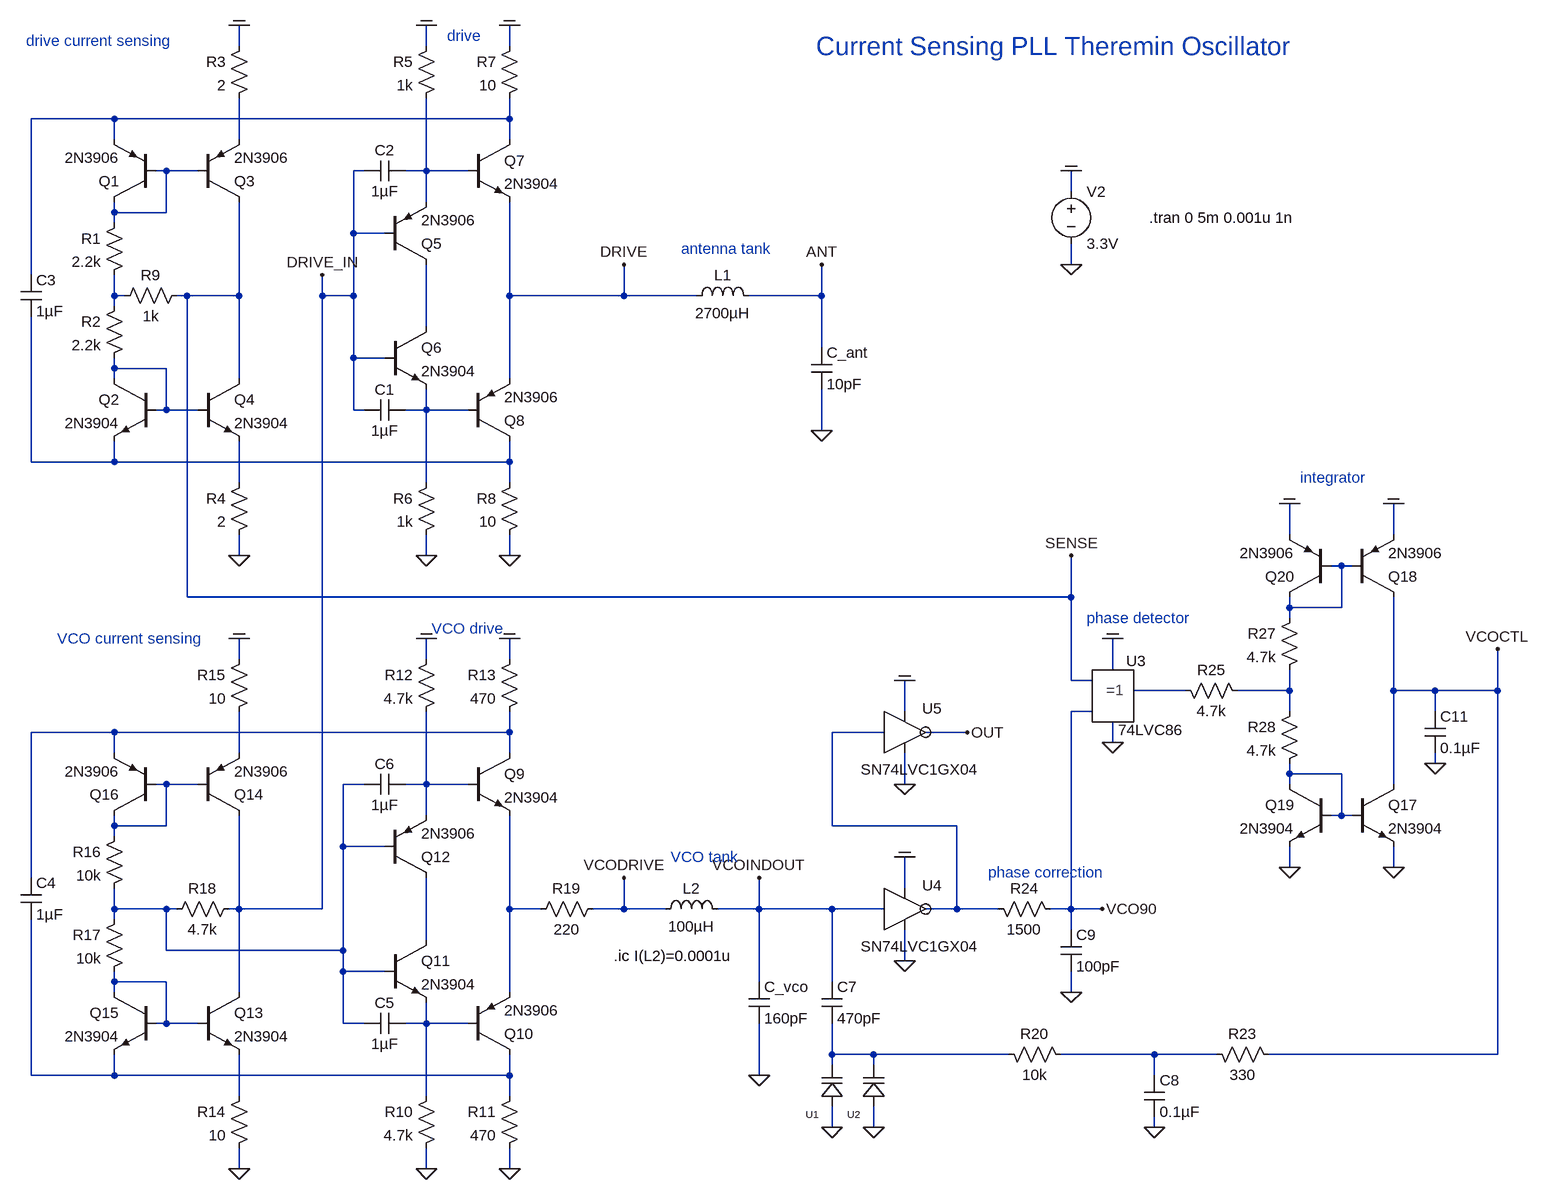
[diagram p0: schematic 2021_current_sensing_pll_bjts_01.asc]
2021_current_sensing_pll_bjts_01.asc, the LTspice schematic file:
Version 4
SHEET 1 13280 8692
WIRE 1984 3888 1984 3856
WIRE 2272 3888 2272 3856
WIRE 2400 3888 2400 3856
WIRE 1792 4000 1664 4000
WIRE 2400 4000 2400 3968
WIRE 2400 4000 1792 4000
WIRE 1792 4032 1792 4000
WIRE 1984 4032 1984 3968
WIRE 2400 4032 2400 4000
WIRE 1872 4080 1856 4080
WIRE 1920 4080 1872 4080
WIRE 2176 4080 2160 4080
WIRE 2272 4080 2272 3968
WIRE 2272 4080 2240 4080
WIRE 2336 4080 2272 4080
WIRE 3264 4112 3264 4080
WIRE 2272 4128 2272 4080
WIRE 1792 4144 1792 4128
WIRE 1872 4144 1872 4080
WIRE 1872 4144 1792 4144
WIRE 1792 4160 1792 4144
WIRE 2160 4176 2160 4080
WIRE 2208 4176 2160 4176
WIRE 3264 4224 3264 4192
WIRE 1664 4240 1664 4000
WIRE 1792 4272 1792 4240
WIRE 1808 4272 1792 4272
WIRE 1904 4272 1888 4272
WIRE 1984 4272 1984 4128
WIRE 1984 4272 1904 4272
WIRE 2112 4272 2112 4240
WIRE 2160 4272 2160 4176
WIRE 2160 4272 2112 4272
WIRE 2400 4272 2400 4128
WIRE 2576 4272 2576 4224
WIRE 2576 4272 2400 4272
WIRE 2688 4272 2576 4272
WIRE 2880 4272 2880 4224
WIRE 2880 4272 2768 4272
WIRE 1792 4288 1792 4272
WIRE 2272 4320 2272 4224
WIRE 2880 4352 2880 4272
WIRE 2160 4368 2160 4272
WIRE 2208 4368 2160 4368
WIRE 1792 4384 1792 4368
WIRE 1872 4384 1792 4384
WIRE 1792 4400 1792 4384
WIRE 1984 4400 1984 4272
WIRE 2400 4400 2400 4272
WIRE 1872 4448 1872 4384
WIRE 1872 4448 1856 4448
WIRE 1920 4448 1872 4448
WIRE 2160 4448 2160 4368
WIRE 2176 4448 2160 4448
WIRE 2272 4448 2272 4416
WIRE 2272 4448 2240 4448
WIRE 2336 4448 2272 4448
WIRE 2880 4480 2880 4416
WIRE 1664 4528 1664 4304
WIRE 1792 4528 1792 4496
WIRE 1792 4528 1664 4528
WIRE 2400 4528 2400 4496
WIRE 2400 4528 1792 4528
WIRE 1984 4560 1984 4496
WIRE 2272 4560 2272 4448
WIRE 2400 4560 2400 4528
WIRE 3600 4640 3600 4592
WIRE 3760 4640 3760 4592
WIRE 1984 4672 1984 4640
WIRE 2272 4672 2272 4640
WIRE 2400 4672 2400 4640
WIRE 3680 4688 3664 4688
WIRE 3696 4688 3680 4688
WIRE 1904 4736 1904 4272
WIRE 3264 4736 3264 4672
WIRE 3264 4736 1904 4736
WIRE 3600 4752 3600 4736
WIRE 3680 4752 3680 4688
WIRE 3680 4752 3600 4752
WIRE 3600 4768 3600 4752
WIRE 1984 4832 1984 4800
WIRE 2272 4832 2272 4800
WIRE 2400 4832 2400 4800
WIRE 3328 4848 3328 4800
WIRE 3264 4864 3264 4736
WIRE 3296 4864 3264 4864
WIRE 3440 4880 3360 4880
WIRE 3600 4880 3600 4848
WIRE 3600 4880 3520 4880
WIRE 3760 4880 3760 4736
WIRE 3824 4880 3760 4880
WIRE 3920 4880 3920 4816
WIRE 3920 4880 3824 4880
WIRE 3008 4912 3008 4864
WIRE 3296 4912 3264 4912
WIRE 3600 4912 3600 4880
WIRE 3824 4912 3824 4880
WIRE 1792 4944 1664 4944
WIRE 2400 4944 2400 4912
WIRE 2400 4944 1792 4944
WIRE 2976 4944 2896 4944
WIRE 3104 4944 3040 4944
WIRE 3328 4960 3328 4928
WIRE 1792 4976 1792 4944
WIRE 1984 4976 1984 4912
WIRE 2400 4976 2400 4944
WIRE 3824 4992 3824 4976
WIRE 3600 5008 3600 4992
WIRE 3680 5008 3600 5008
WIRE 1872 5024 1856 5024
WIRE 1920 5024 1872 5024
WIRE 2176 5024 2144 5024
WIRE 2272 5024 2272 4912
WIRE 2272 5024 2240 5024
WIRE 2336 5024 2272 5024
WIRE 3008 5024 3008 4976
WIRE 3600 5024 3600 5008
WIRE 3760 5024 3760 4880
WIRE 2272 5072 2272 5024
WIRE 3680 5072 3680 5008
WIRE 3680 5072 3664 5072
WIRE 3696 5072 3680 5072
WIRE 1792 5088 1792 5072
WIRE 1872 5088 1872 5024
WIRE 1872 5088 1792 5088
WIRE 2896 5088 2896 4944
WIRE 3088 5088 2896 5088
WIRE 1792 5104 1792 5088
WIRE 2144 5120 2144 5024
WIRE 2208 5120 2144 5120
WIRE 3600 5152 3600 5120
WIRE 3760 5152 3760 5120
WIRE 1664 5168 1664 4944
WIRE 3008 5184 3008 5136
WIRE 1792 5216 1792 5184
WIRE 1872 5216 1792 5216
WIRE 1888 5216 1872 5216
WIRE 1984 5216 1984 5072
WIRE 1984 5216 1968 5216
WIRE 2112 5216 2112 4272
WIRE 2112 5216 1984 5216
WIRE 2400 5216 2400 5072
WIRE 2448 5216 2400 5216
WIRE 2576 5216 2576 5168
WIRE 2576 5216 2528 5216
WIRE 2640 5216 2576 5216
WIRE 2784 5216 2784 5168
WIRE 2784 5216 2720 5216
WIRE 2896 5216 2784 5216
WIRE 2976 5216 2896 5216
WIRE 3088 5216 3088 5088
WIRE 3088 5216 3040 5216
WIRE 3152 5216 3088 5216
WIRE 3264 5216 3264 4912
WIRE 3264 5216 3232 5216
WIRE 3312 5216 3264 5216
WIRE 1792 5232 1792 5216
WIRE 3264 5248 3264 5216
WIRE 2272 5264 2272 5168
WIRE 1872 5280 1872 5216
WIRE 2144 5280 2144 5120
WIRE 2144 5280 1872 5280
WIRE 3008 5296 3008 5248
WIRE 2144 5312 2144 5280
WIRE 2208 5312 2144 5312
WIRE 1792 5328 1792 5312
WIRE 1872 5328 1792 5328
WIRE 2784 5328 2784 5216
WIRE 2896 5328 2896 5216
WIRE 1792 5344 1792 5328
WIRE 1984 5344 1984 5216
WIRE 2400 5344 2400 5216
WIRE 3264 5344 3264 5312
WIRE 1872 5392 1872 5328
WIRE 1872 5392 1856 5392
WIRE 1920 5392 1872 5392
WIRE 2144 5392 2144 5312
WIRE 2176 5392 2144 5392
WIRE 2272 5392 2272 5360
WIRE 2272 5392 2240 5392
WIRE 2336 5392 2272 5392
WIRE 2896 5440 2896 5392
WIRE 2960 5440 2896 5440
WIRE 3168 5440 2960 5440
WIRE 3392 5440 3248 5440
WIRE 3488 5440 3392 5440
WIRE 3920 5440 3920 4880
WIRE 3920 5440 3568 5440
WIRE 2896 5456 2896 5440
WIRE 2960 5456 2960 5440
WIRE 1664 5472 1664 5232
WIRE 1792 5472 1792 5440
WIRE 1792 5472 1664 5472
WIRE 2400 5472 2400 5440
WIRE 2400 5472 1792 5472
WIRE 2784 5472 2784 5392
WIRE 3392 5472 3392 5440
WIRE 1984 5504 1984 5440
WIRE 2272 5504 2272 5392
WIRE 2400 5504 2400 5472
WIRE 2896 5552 2896 5520
WIRE 2960 5552 2960 5520
WIRE 3392 5552 3392 5536
WIRE 1984 5616 1984 5584
WIRE 2272 5616 2272 5584
WIRE 2400 5616 2400 5584
FLAG 3264 4224 0
FLAG 3264 4080 COM
FLAG 1984 4672 0
FLAG 1984 3856 COM
FLAG 2880 4480 0
FLAG 2880 4224 ANT
FLAG 2576 4224 DRIVE
FLAG 2272 4672 0
FLAG 2400 4672 0
FLAG 2272 3856 COM
FLAG 2400 3856 COM
FLAG 2112 4240 DRIVE_IN
FLAG 2272 5616 0
FLAG 2400 5616 0
FLAG 2272 4800 COM
FLAG 2400 4800 COM
FLAG 2784 5472 0
FLAG 2784 5168 VCOINDOUT
FLAG 2576 5168 VCODRIVE
FLAG 1984 5616 0
FLAG 1984 4800 COM
FLAG 2896 5552 0
FLAG 2960 5552 0
FLAG 3392 5552 0
FLAG 3328 4800 COM
FLAG 3328 4960 0
FLAG 3008 5136 COM
FLAG 3008 4864 COM
FLAG 3008 5296 0
FLAG 3008 5024 0
FLAG 3104 4944 OUT
FLAG 3264 5344 0
FLAG 3760 5152 0
FLAG 3760 4592 COM
FLAG 3600 4592 COM
FLAG 3600 5152 0
FLAG 3824 4992 0
FLAG 3264 4672 SENSE
FLAG 3312 5216 VCO90
FLAG 3920 4816 VCOCTL
SYMBOL voltage 3264 4096 R0
WINDOW 123 0 0 Left 2
WINDOW 39 0 0 Left 2
SYMATTR InstName V2
SYMATTR Value 3.3V
SYMBOL npn 1920 4400 R0
SYMATTR InstName Q4
SYMATTR Value 2N3904
SYMBOL pnp 1920 4128 M180
SYMATTR InstName Q3
SYMATTR Value 2N3906
SYMBOL npn 1856 4400 M0
SYMATTR InstName Q2
SYMATTR Value 2N3904
SYMBOL pnp 1856 4128 R180
SYMATTR InstName Q1
SYMATTR Value 2N3906
SYMBOL res 2000 4544 M0
WINDOW 0 36 40 Left 2
WINDOW 3 36 76 Left 2
SYMATTR InstName R4
SYMATTR Value 2
SYMBOL res 2000 3872 M0
WINDOW 0 36 40 Left 2
WINDOW 3 36 76 Left 2
SYMATTR InstName R3
SYMATTR Value 2
SYMBOL res 1808 4144 M0
WINDOW 0 36 40 Left 2
WINDOW 3 36 76 Left 2
SYMATTR InstName R1
SYMATTR Value 2.2k
SYMBOL res 1808 4272 M0
WINDOW 0 36 40 Left 2
WINDOW 3 36 76 Left 2
SYMATTR InstName R2
SYMATTR Value 2.2k
SYMBOL ind 2672 4288 R270
WINDOW 0 32 56 VTop 2
WINDOW 3 5 56 VBottom 2
SYMATTR InstName L1
SYMATTR Value 2700µH
SYMATTR SpiceLine Rser=120 Cpar=1.2pF
SYMBOL cap 2864 4352 R0
SYMATTR InstName C_ant
SYMATTR Value 10pF
SYMBOL npn 2336 4032 R0
SYMATTR InstName Q7
SYMATTR Value 2N3904
SYMBOL pnp 2336 4496 M180
SYMATTR InstName Q8
SYMATTR Value 2N3906
SYMBOL npn 2208 4320 R0
SYMATTR InstName Q6
SYMATTR Value 2N3904
SYMBOL pnp 2208 4224 M180
SYMATTR InstName Q5
SYMATTR Value 2N3906
SYMBOL res 2288 4544 M0
WINDOW 0 36 40 Left 2
WINDOW 3 36 76 Left 2
SYMATTR InstName R6
SYMATTR Value 1k
SYMBOL res 2416 4544 M0
WINDOW 0 36 40 Left 2
WINDOW 3 36 76 Left 2
SYMATTR InstName R8
SYMATTR Value 10
SYMBOL res 2288 3872 M0
WINDOW 0 36 40 Left 2
WINDOW 3 36 76 Left 2
SYMATTR InstName R5
SYMATTR Value 1k
SYMBOL res 2416 3872 M0
WINDOW 0 36 40 Left 2
WINDOW 3 36 76 Left 2
SYMATTR InstName R7
SYMATTR Value 10
SYMBOL cap 1648 4240 R0
SYMATTR InstName C3
SYMATTR Value 1µF
SYMBOL res 1904 4256 R90
WINDOW 0 0 56 VBottom 2
WINDOW 3 32 56 VTop 2
SYMATTR InstName R9
SYMATTR Value 1k
SYMBOL cap 2240 4432 R90
WINDOW 0 0 32 VBottom 2
WINDOW 3 32 32 VTop 2
SYMATTR InstName C1
SYMATTR Value 1µF
SYMBOL cap 2240 4064 R90
WINDOW 0 0 32 VBottom 2
WINDOW 3 32 32 VTop 2
SYMATTR InstName C2
SYMATTR Value 1µF
SYMBOL npn 2336 4976 R0
SYMATTR InstName Q9
SYMATTR Value 2N3904
SYMBOL pnp 2336 5440 M180
SYMATTR InstName Q10
SYMATTR Value 2N3906
SYMBOL npn 2208 5264 R0
SYMATTR InstName Q11
SYMATTR Value 2N3904
SYMBOL pnp 2208 5168 M180
SYMATTR InstName Q12
SYMATTR Value 2N3906
SYMBOL res 2288 5488 M0
WINDOW 0 36 40 Left 2
WINDOW 3 36 76 Left 2
SYMATTR InstName R10
SYMATTR Value 4.7k
SYMBOL res 2416 5488 M0
WINDOW 0 36 40 Left 2
WINDOW 3 36 76 Left 2
SYMATTR InstName R11
SYMATTR Value 470
SYMBOL res 2288 4816 M0
WINDOW 0 36 40 Left 2
WINDOW 3 36 76 Left 2
SYMATTR InstName R12
SYMATTR Value 4.7k
SYMBOL res 2416 4816 M0
WINDOW 0 36 40 Left 2
WINDOW 3 36 76 Left 2
SYMATTR InstName R13
SYMATTR Value 470
SYMBOL cap 1648 5168 R0
SYMATTR InstName C4
SYMATTR Value 1µF
SYMBOL cap 2240 5376 R90
WINDOW 0 0 32 VBottom 2
WINDOW 3 32 32 VTop 2
SYMATTR InstName C5
SYMATTR Value 1µF
SYMBOL cap 2240 5008 R90
WINDOW 0 0 32 VBottom 2
WINDOW 3 32 32 VTop 2
SYMATTR InstName C6
SYMATTR Value 1µF
SYMBOL ind 2624 5232 R270
WINDOW 0 32 56 VTop 2
WINDOW 3 5 56 VBottom 2
SYMATTR InstName L2
SYMATTR Value 100µH
SYMATTR SpiceLine Rser=120 Cpar=1.2pF
SYMBOL cap 2768 5328 R0
SYMATTR InstName C_vco
SYMATTR Value 160pF
SYMBOL npn 1920 5344 R0
SYMATTR InstName Q13
SYMATTR Value 2N3904
SYMBOL pnp 1920 5072 M180
SYMATTR InstName Q14
SYMATTR Value 2N3906
SYMBOL npn 1856 5344 M0
SYMATTR InstName Q15
SYMATTR Value 2N3904
SYMBOL pnp 1856 5072 R180
SYMATTR InstName Q16
SYMATTR Value 2N3906
SYMBOL res 2000 5488 M0
WINDOW 0 36 40 Left 2
WINDOW 3 36 76 Left 2
SYMATTR InstName R14
SYMATTR Value 10
SYMBOL res 2000 4816 M0
WINDOW 0 36 40 Left 2
WINDOW 3 36 76 Left 2
SYMATTR InstName R15
SYMATTR Value 10
SYMBOL res 1808 5088 M0
WINDOW 0 36 40 Left 2
WINDOW 3 36 76 Left 2
SYMATTR InstName R16
SYMATTR Value 10k
SYMBOL res 1808 5216 M0
WINDOW 0 36 40 Left 2
WINDOW 3 36 76 Left 2
SYMATTR InstName R17
SYMATTR Value 10k
SYMBOL res 1984 5200 R90
WINDOW 0 0 56 VBottom 2
WINDOW 3 32 56 VTop 2
SYMATTR InstName R18
SYMATTR Value 4.7k
SYMBOL res 2544 5200 R90
WINDOW 0 0 56 VBottom 2
WINDOW 3 32 56 VTop 2
SYMATTR InstName R19
SYMATTR Value 220
SYMBOL BBY65-02V 2912 5520 R180
SYMATTR InstName U1
SYMBOL BBY65-02V 2976 5520 R180
SYMATTR InstName U2
SYMBOL cap 2880 5328 R0
SYMATTR InstName C7
SYMATTR Value 470pF
SYMBOL res 3264 5456 M270
WINDOW 0 32 56 VTop 2
WINDOW 3 0 56 VBottom 2
SYMATTR InstName R20
SYMATTR Value 10k
SYMBOL cap 3376 5472 R0
SYMATTR InstName C8
SYMATTR Value 0.1µF
SYMBOL res 3584 5456 M270
WINDOW 0 32 56 VTop 2
WINDOW 3 0 56 VBottom 2
SYMATTR InstName R23
SYMATTR Value 330
SYMBOL 74lvc86a 3344 4880 R0
SYMATTR InstName U3
SYMBOL res 3248 5232 M270
WINDOW 0 32 56 VTop 2
WINDOW 3 0 56 VBottom 2
SYMATTR InstName R24
SYMATTR Value 1500
SYMBOL cap 3248 5248 R0
SYMATTR InstName C9
SYMATTR Value 100pF
SYMBOL npn 3696 5024 R0
SYMATTR InstName Q17
SYMATTR Value 2N3904
SYMBOL pnp 3696 4736 M180
SYMATTR InstName Q18
SYMATTR Value 2N3906
SYMBOL npn 3664 5024 M0
SYMATTR InstName Q19
SYMATTR Value 2N3904
SYMBOL pnp 3664 4736 R180
SYMATTR InstName Q20
SYMATTR Value 2N3906
SYMBOL res 3616 4752 M0
WINDOW 0 36 40 Left 2
WINDOW 3 36 76 Left 2
SYMATTR InstName R27
SYMATTR Value 4.7k
SYMBOL res 3616 4896 M0
WINDOW 0 36 40 Left 2
WINDOW 3 36 76 Left 2
SYMATTR InstName R28
SYMATTR Value 4.7k
SYMBOL res 3536 4896 M270
WINDOW 0 32 56 VTop 2
WINDOW 3 0 56 VBottom 2
SYMATTR InstName R25
SYMATTR Value 4.7k
SYMBOL cap 3808 4912 R0
SYMATTR InstName C11
SYMATTR Value 0.1µF
SYMBOL SN74LVC1GX04 3008 5216 R0
SYMATTR InstName U4
SYMBOL SN74LVC1GX04 3008 4944 R0
SYMATTR InstName U5
TEXT 3384 4152 Left 2 !.tran 0 5m 0.001u 1n
TEXT 2560 5288 Left 2 !.ic I(L2)=0.0001u
TEXT 3616 4552 Left 2 ;integrator
TEXT 1704 4800 Left 2 ;VCO current sensing
TEXT 1656 3880 Left 2 ;drive current sensing
TEXT 2648 5136 Left 2 ;VCO tank
TEXT 2304 3872 Left 2 ;drive
TEXT 2280 4784 Left 2 ;VCO drive
TEXT 2664 4200 Left 2 ;antenna tank
TEXT 3288 4768 Left 2 ;phase detector
TEXT 2872 3888 Left 4 ;Current Sensing PLL Theremin Oscillator
TEXT 3136 5160 Left 2 ;phase correction

The netlist it stands for:
* 2021_current_sensing_pll_bjts_01.asc
V2 COM 0 3.3V
Q4 SENSE N007 N010 0 2N3904
Q3 SENSE N003 N002 0 2N3906
Q2 N007 N007 N009 0 2N3904
Q1 N003 N003 N001 0 2N3906
R4 N010 0 2
R3 COM N002 2
R1 N003 N005 2.2k
R2 N005 N007 2.2k
L1 DRIVE ANT 2700µH Rser=120 Cpar=1.2pF
C_ant ANT 0 10pF
Q7 N001 N004 DRIVE 0 2N3904
Q8 N009 N008 DRIVE 0 2N3906
Q6 N006 DRIVE_IN N008 0 2N3904
Q5 N006 DRIVE_IN N004 0 2N3906
R6 N008 0 1k
R8 N009 0 10
R5 COM N004 1k
R7 COM N001 10
C3 N001 N009 1µF
R9 SENSE N005 1k
C1 N008 DRIVE_IN 1µF
C2 N004 DRIVE_IN 1µF
Q9 N014 N020 N021 0 2N3904
Q10 N027 N024 N021 0 2N3906
Q11 N022 N019 N024 0 2N3904
Q12 N022 N019 N020 0 2N3906
R10 N024 0 4.7k
R11 N027 0 470
R12 COM N020 4.7k
R13 COM N014 470
C4 N014 N027 1µF
C5 N024 N019 1µF
C6 N020 N019 1µF
L2 VCODRIVE VCOINDOUT 100µH Rser=120 Cpar=1.2pF
C_vco VCOINDOUT 0 160pF
Q13 DRIVE_IN N023 N028 0 2N3904
Q14 DRIVE_IN N018 N016 0 2N3906
Q15 N023 N023 N027 0 2N3904
Q16 N018 N018 N014 0 2N3906
R14 N028 0 10
R15 COM N016 10
R16 N018 N019 10k
R17 N019 N023 10k
R18 DRIVE_IN N019 4.7k
R19 VCODRIVE N021 220
XU1 N025 0 BBY65-02V  ; pins k a
XU2 N025 0 BBY65-02V  ; pins k a
C7 VCOINDOUT N025 470pF
R20 N026 N025 10k
C8 N026 0 0.1µF
R23 VCOCTL N026 330
XU3 N012 VCO90 SENSE COM 0 74LVC86  ; pins Y A B VCC AGND
R24 VCO90 N015 1500
C9 VCO90 0 100pF
Q17 VCOCTL N017 0 0 2N3904
Q18 VCOCTL N011 COM 0 2N3906
Q19 N017 N017 0 0 2N3904
Q20 N011 N011 COM 0 2N3906
R27 N011 N013 4.7k
R28 N013 N017 4.7k
R25 N013 N012 4.7k
C11 VCOCTL 0 0.1µF
XU4 N015 VCOINDOUT COM 0 SN74LVC1GX04  ; pins Y A VCC AGND
XU5 OUT N015 COM 0 SN74LVC1GX04  ; pins Y A VCC AGND
.model NPN NPN
.model PNP PNP
.lib standard.bjt
.tran 0 5m 0.001u 1n
.ic I(L2)=0.0001u
* integrator
* VCO current sensing
* drive current sensing
* VCO tank
* drive
* VCO drive
* antenna tank
* phase detector
* Current Sensing PLL Theremin Oscillator
* phase correction
.lib BBY65-02V.cir
.lib 74lvc86a.cir
.lib SN74LVC1GX04.cir
.backanno
.end